# EAGLE design openSX70_ALADDIN_V398SEEED_20180219 (EAGLE 8.6.3)
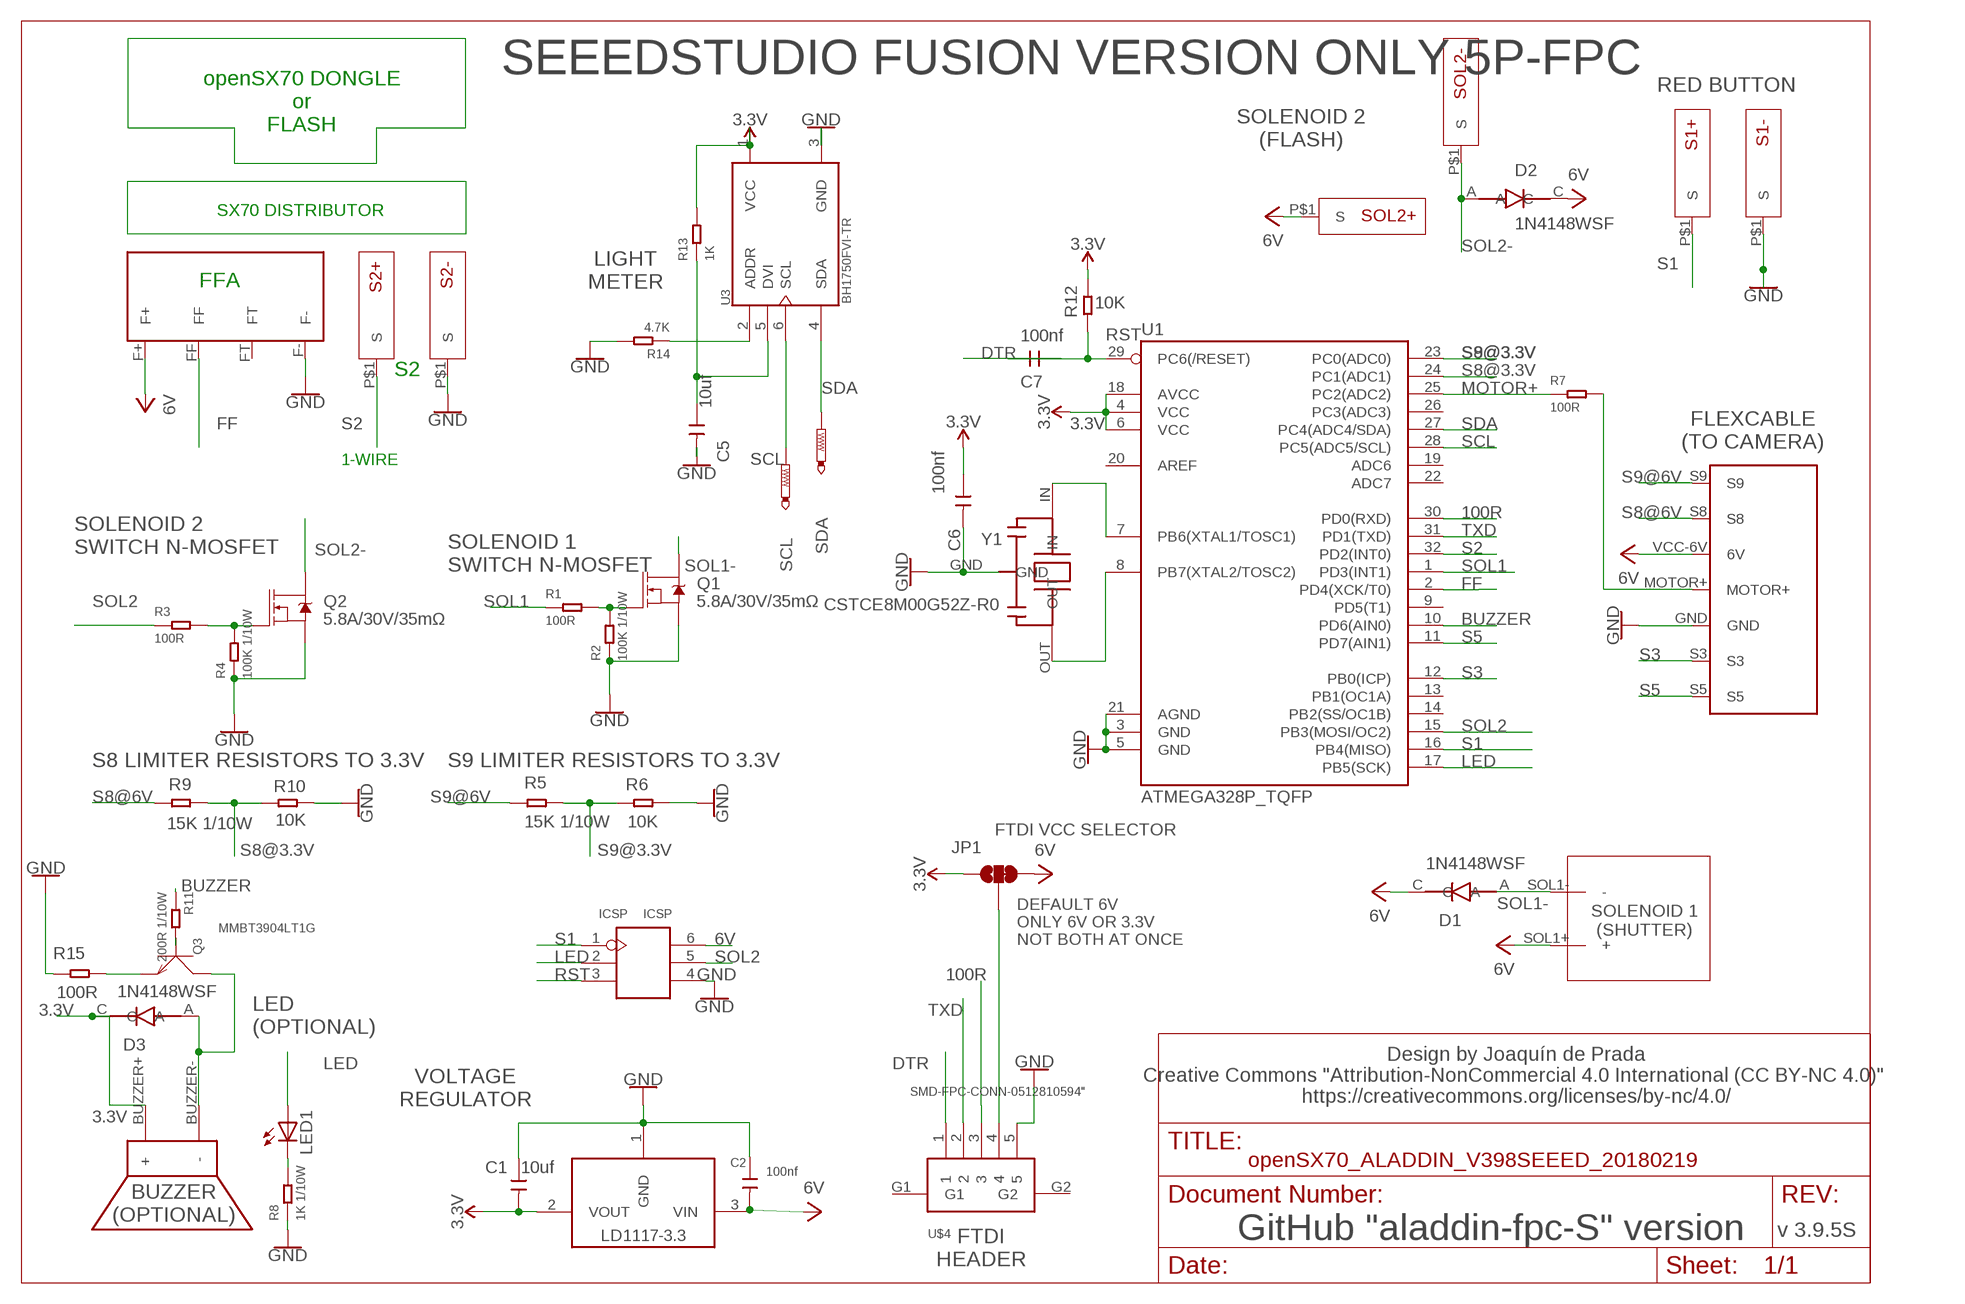
[diagram p0: schematic, sheet 1]

## Parts
C1  10uf  CERAMIC-10UF-10V-10%-X5R(0603)  [C0603]
C2  100nf  CERAMIC-100NF-50V-10%-X7R(0603)  [C0603]
C5  10uf  CERAMIC-10UF-10V-10%-X5R(0603)  [C0603]
C6  100nf  CERAMIC-100NF-50V-10%-X7R(0603)  [C0603]
C7  100nf  CERAMIC-100NF-50V-10%-X7R(0603)  [C0603]
D1  1N4148WSF  1N4148WS  [SODFL2512X100N]
D2  1N4148WSF  1N4148WS  [SODFL2512X100N]
D3  1N4148WSF  1N4148WS  [SODFL2512X100N]
ICSP  ICSP  [H2X3-2.54]
JP1  FTDI VCC SELECTOR  JUMPER-SMT_3_1-NC_TRACE_SILK  [SMT-JUMPER_3_1-NC_TRACE_SILK]
LD11172.5V  LD1117 2.5V  LD1117-3.3  [SOT223]
LED1  LEDCHIPLED_0805  [CHIPLED_0805]
Q1  5.8A/30V/35mΩ  MOSFET-NCH-AO3404A  [SOT23-3]
Q2  5.8A/30V/35mΩ  MOSFET-NCH-AO3404A  [SOT23-3]
Q3  MMBT3904LT1G  SMD-TRANSISTORS-NPN-40V-200MA-MMBT3904LT1G(SOT-23)  [SOT-23]
R1  100R  SMD-RES-100R-5%-1/10W(0603)  [R0603]
R2  100K 1/10W  SMD-RES-100K-5%-1/10W(0603)  [R0603]
R3  100R  SMD-RES-100R-5%-1/10W(0603)  [R0603]
R4  100K 1/10W  SMD-RES-100K-5%-1/10W(0603)  [R0603]
R5  15K 1/10W  SMD-RES-15K-1%-1/10W(0603)  [R0603]
R6  10K  SMD-RES-10K-1%-1/10W(0603)  [R0603]
R7  100R  SMD-RES-100R-5%-1/10W(0603)  [R0603]
R8  1K 1/10W  SMD-RES-1K-5%-1/10W(0603)  [R0603]
R9  15K 1/10W  SMD-RES-15K-1%-1/10W(0603)  [R0603]
R10  10K  SMD-RES-10K-1%-1/10W(0603)  [R0603]
R11  200R 1/10W  SMD-RES-200R-5%-1/10W(0603)  [R0603]
R12  10K  SMD-RES-10K-1%-1/10W(0603)  [R0603]
R13  1K  SMD-RES-1K-1%-1/10W(0603)  [R0603]
R14  4.7K  SMD-RES-4.7K-5%-1/10W(0603)  [R0603]
R15  100R  SMD-RES-100R-5%-1/10W(0603)  [R0603]
S1+  SX70-S-PAD-NEW  [SX70-S-PAD2]
S1-  SX70-S-PAD-NEW  [SX70-S-PAD2]
S2+  SX70-S-PAD-NEW  [SX70-S-PAD2]
S2-  SX70-S-PAD-NEW  [SX70-S-PAD2]
SCL  PTR1TP08R  [TP08R]
SDA  PTR1TP08R  [TP08R]
SOL1  SX70-SOLENOID1-2PADS  [SX70-SOLENOID1-2]
SOL2+  SX70-S-PAD-NEW  [SX70-S-PAD2]
SOL2-  SX70-S-PAD-NEW  [SX70-S-PAD2]
U1  ATMEGA328P_TQFP  [TQFP32-08]
U3  BH1750FVI-TR  [SOTFL50P300X75-6N]
U$1  SX70-7-PAD  [SX70-7-PAD]
U$2  FFA  SX70-FFA-PAD  [FFA-PAD-PACKAGE]
U$3  CSET8-5G_V2  [CSET8-5G_PACKAGE]
U$4  SMD-FPC-CONN-0512810594"  [51281-0594]
Y1  CSTCE8M00G52Z-R0  CSTCE16M0V53-R0  [CFP95P160X100-3N]

## Nets
3.3V: C1.2 C6.1 D3.C JP1.1 LD11172.5V.2(VOUT) R12.2 R13.2 U1.4(VCC) U1.6(VCC) U1.18(AVCC) U3.1(VCC) U$3.BUZZER+(+)
6V: C2.2 D1.C D2.C ICSP.6(VCC) JP1.3 LD11172.5V.3(VIN) SOL1.SOL1+(+) SOL2+.P$1(S) U$1.VCC-6V(6V) U$2.F+
100R: U1.30(PD0(RXD)) U$4.3
BUZZER: R11.1 U1.10(PD6(AIN0))
BUZZER-: D3.A Q3.3(C) U$3.BUZZER-(-)
DTR: C7.1 U$4.1
FF: U1.2(PD4(XCK/T0)) U$2.FF
GND: C1.1 C2.1 C5.2 C6.2 ICSP.4(GND) LD11172.5V.1(GND) Q1.2(S) Q2.2(S) R2.1 R4.1 R6.2 R8.1 R10.2 R14.2 R15.1 S1-.P$1(S) S2-.P$1(S) U1.3(GND) U1.5(GND) U1.21(AGND) U3.3(GND) U$1.GND U$2.F- U$4.5 Y1.GND
LED: ICSP.2(SCK) LED1.A U1.17(PB5(SCK))
MOTOR+: R7.1 U1.25(PC2(ADC2))
MOTOR-HEADER: R7.2 U$1.MOTOR+
N$1: Q1.1(G) R1.2 R2.2
N$2: C5.1 R13.1 U3.5(DVI)
N$3: Q2.1(G) R3.2 R4.2
N$4: U1.7(PB6(XTAL1/TOSC1)) Y1.IN
N$5: LED1.C R8.2
N$6: U1.8(PB7(XTAL2/TOSC2)) Y1.OUT
N$9: Q3.1(B) R11.2
N$10: R14.1 U3.2(ADDR)
N$27: JP1.2 U$4.4
N$28: Q3.2(E) R15.2
RST: C7.2 ICSP.3(RST) R12.1 U1.29(PC6(/RESET))
S1: ICSP.1(MISO) S1+.P$1(S) U1.16(PB4(MISO))
S2: S2+.P$1(S) U1.32(PD2(INT0))
S3: U1.12(PB0(ICP)) U$1.S3
S5: U1.11(PD7(AIN1)) U$1.S5
S8@3.3V: R9.2 R10.1 U1.24(PC1(ADC1))
S8@6V: R9.1 U$1.S8
S9@3.3V: R5.2 R6.1 U1.23(PC0(ADC0))
S9@6V: R5.1 U$1.S9
SCL: SCL.TP U1.28(PC5(ADC5/SCL)) U3.6(SCL)
SDA: SDA.TP U1.27(PC4(ADC4/SDA)) U3.4(SDA)
SOL1: R1.1 U1.1(PD3(INT1))
SOL1-: D1.A Q1.3(D) SOL1.SOL1-(-)
SOL2: ICSP.5(MOSI) R3.1 U1.15(PB3(MOSI/OC2))
SOL2-: D2.A Q2.3(D) SOL2-.P$1(S)
TXD: U1.31(PD1(TXD)) U$4.2
Unconnected: U1.9(PD5(T1)) U1.13(PB1(OC1A)) U1.14(PB2(SS/OC1B)) U1.19(ADC6) U1.20(AREF) U1.22(ADC7) U1.26(PC3(ADC3)) U$2.FT U$4.G1 U$4.G2

## Notes on the sheet
- SEEEDSTUDIO FUSION VERSION ONLY 5P-FPC
- RED BUTTON
- openSX70 DONGLE
  or
  FLASH
- SOLENOID 2
  (FLASH)
- SX70 DISTRIBUTOR
- LIGHT
  METER
- FFA
- S2
- FLEXCABLE
  (TO CAMERA)
- 1-WIRE
- SOLENOID 2
  SWITCH N-MOSFET
- SOLENOID 1
  SWITCH N-MOSFET
- S8 LIMITER RESISTORS TO 3.3V | S9 LIMITER RESISTORS TO 3.3V
- SOLENOID 1
  (SHUTTER)
- DEFAULT 6V
  ONLY 6V OR 3.3V
  NOT BOTH AT ONCE
- LED
  (OPTIONAL)
- Design by Joaquín de Prada
  Creative Commons "Attribution-NonCommercial 4.0 International (CC BY-NC 4.0)" 
  https://creativecommons.org/licenses/by-nc/4.0/
- VOLTAGE
  REGULATOR
- BUZZER
  (OPTIONAL)
- v 3.9.5S
- GitHub "aladdin-fpc-S" version
- FTDI
  HEADER

## Library data of the parts
C1 C5 = Seeed-Capacitor:CERAMIC-10UF-10V-10%-X5R(0603): 302010103; MPN: CC0603KRX5R6BB106
C2 C6 C7 = Seeed-Capacitor:CERAMIC-100NF-50V-10%-X7R(0603): 302010138; MPN: CC0603KRX7R9BB104
D1-D3 = Common-Parts-Library-Eagle:1N4148WS: 1N4148WS Series 75 V 300 mA Surface Mount Small Signal Diodes - SOD-323F; MANUFACTURER: Fairchild Semiconductor
ICSP = openSX70:ICSP
JP1 = SparkFun-Jumpers:JUMPER-SMT_3_1-NC_TRACE: Normally closed trace jumper (1 of 2 connections) This jumper has a trace between two pads so it's normally closed (NC). The other connection is normally open (NO). Use a razor knife to open the connection. For best results follow the IPC guidelines for cutting traces: Cutout at least 0.063 mm (0.005 in). Remove all loose material to clean up the cut area. Seal the cut with an approved epoxy. Reapply solder to reclose the connection, or to close the NO connection.
LD11172.5V = openSX70:LD1117-3.3; AVAILABILITY: Unavailable; DESCRIPTION: Sot223/Pkg 1-Amp 5-Volt Low Drop Out Voltage Regulatator; MF: Advanced Monolithic Systems; MP: AMS1117-5.0; PACKAGE: None; PRICE: None
LED1 = led:LED: LED OSRAM: - CHIPLED LG R971, LG N971, LY N971, LG Q971, LY Q971, LO R971, LY R971 LH N974, LH R974 LS Q976, LO Q976, LY Q976 LO Q996 - Hyper CHIPLED LW Q18S LB Q993, LB Q99A, LB R99A - SideLED LS A670, LO A670, LY A670, LG A670, LP A670 LB A673, LV A673, LT A673, LW A673 LH A674 LY A675 LS A676, LA A676, LO A676, LY A676, LW A676 LS A679, LY A679, LG A679 - Hyper Micro SIDELED® LS Y876, LA Y876, LO Y876, LY Y876 LT Y87S - SmartLED LW L88C, LW L88S LB L89C, LB L89S, LG L890 LS L89K, LO L89K, LY L89K LS L896, LA L896, LO L896, LY L896 - TOPLED LS T670, LO T670, LY T670, LG T670, LP T670 LSG T670, LSP T670, LSY T670, LOP T670, LYG T670 LG T671, LOG T671, LSG T671 LB T673, LV T673, LT T673, LW T673 LH T674 LS T676, LA T676, LO T676, LY T676, LB T676, LH T676, LSB T676, LW T676 LB T67C, LV T67C, LT T67C, LS T67K, LO T67K, LY T67K, LW E67C LS E67B, LA E67B, LO E67B, LY E67B, LB E67C, LV E67C, LT E67C LW T67C LS T679, LY T679, LG T679 LS T770, LO T770, LY T770, LG T770, LP T770 LB T773, LV T773, LT T773, LW T773 LH T774 LS E675, LA E675, LY E675, LS T675 LS T776, LA T776, LO T776, LY T776, LB T776 LHGB T686 LT T68C, LB T68C - Hyper Mini TOPLED® LB M676 - Mini TOPLED Santana® LG M470 LS M47K, LO M47K, LY M47K Source: http://www.osram.convergy.de LUXEON: - LUMILED® LXK2-PW12-R00, LXK2-PW12-S00, LXK2-PW14-U00, LXK2-PW14-V00 LXK2-PM12-R00, LXK2-PM12-S00, LXK2-PM14-U00 LXK2-PE12-Q00, LXK2-PE12-R00, LXK2-PE12-S00, LXK2-PE14-T00, LXK2-PE14-U00 LXK2-PB12-K00, LXK2-PB12-L00, LXK2-PB12-M00, LXK2-PB14-N00, LXK2-PB14-P00, LXK2-PB14-Q00 LXK2-PR12-L00, LXK2-PR12-M00, LXK2-PR14-Q00, LXK2-PR14-R00 LXK2-PD12-Q00, LXK2-PD12-R00, LXK2-PD12-S00 LXK2-PH12-R00, LXK2-PH12-S00 LXK2-PL12-P00, LXK2-PL12-Q00, LXK2-PL12-R00 Source: www.luxeon.com KINGBRIGHT: KA-3528ASYC Source: www.kingbright.com
Q1 Q2 = openSX70:MOSFET-NCH: N-channel MOSFETs Voltage controlled devices that allow control of high current outputs. SparkFun Products: SparkFun OpenScale <https://www.sparkfun.com/products/13261> SparkFun Digital Sandbox <https://www.sparkfun.com/products/12651> SparkFun Monster Moto Shield <https://www.sparkfun.com/products/10182> SparkFun MOSFET Power Controller <https://www.sparkfun.com/products/11214>; PROD_ID: TRANS-12988
Q3 = Seeed-Transistor:SMD-TRANSISTORS-NPN-40V-200MA-MMBT3904LT1G(SOT-23): 305010013; MPN: MMBT3904LT1G
R1 R3 R7 R15 = Seeed-Resistor:SMD-RES-100R-5%-1/10W(0603): 301010090; MPN: RC0603JR-07100RL
R2 R4 = Seeed-Resistor:SMD-RES-100K-5%-1/10W(0603): 301010089; MPN: RC0603JR-07100KL
R5 R9 = Seeed-Resistor:SMD-RES-15K-1%-1/10W(0603): 301010241; MPN: RC0603FR-0715KL
R6 R10 R12 = Seeed-Resistor:SMD-RES-10K-1%-1/10W(0603): 301010299; MPN: RC0603FR-0710KL
R8 = Seeed-Resistor:SMD-RES-1K-5%-1/10W(0603): 301010291; MPN: RC0603JR-071KL
R11 = Seeed-Resistor:SMD-RES-200R-5%-1/10W(0603): 301010218; MPN: RC0603JR-07200RL
R13 = Seeed-Resistor:SMD-RES-1K-1%-1/10W(0603): 301010298; MPN: RC0603FR-071KL
R14 = Seeed-Resistor:SMD-RES-4.7K-5%-1/10W(0603): 301010290; MPN: RC0603JR-074K7L
S1+ S1- S2+ S2- SOL2+ SOL2- = openSX70:SX70-S-PAD-NEW
SCL SDA = testpad:PTR1: TEST PIN
SOL1 = openSX70:SX70-SOLENOID1-2PADS
U1 = openSX70:ATMEGA328P_TQFP: Popular 328P in QFP Storefront component: ATmega328 - TQFP (COM-13448) Datasheet SparkFun Products SparkFun RedBoard - Programmed with Arduino (DEV-12757) Arduino Pro Mini 328 - 5V/16MHz (DEV-11113) Arduino Pro Mini 328 - 3.3V/8MHz (DEV-11114) SparkFun OpenLog (DEV-13712) SparkFun MicroView - OLED Arduino Module (DEV-12923) SparkFun Digital Sandbox (DEV-12651) SparkFun PicoBoard (WIG-11888) Arduino Fio (DEV-10116) LilyPad Arduino 328 Main Board (DEV-13342) SparkFun RedStick (DEV-13741) LilyPad MP3 (DEV-11013) LilyPad Arduino SimpleSnap (DEV-10941) SparkFun Stepoko (ROB-13899) SparkFun Geiger Counter (SEN-11345) SparkFun EL Sequencer (COM-12781) Arduino Pro 328 - 5V/16MHz (DEV-10915) CryptoCape (DEV-12773) SparkFun IR Thermometer Evaluation Board - MLX90614 (SEN-10740) SparkFun RedBot Mainboard (ROB-12097) Arduino Pro 328 - 3.3V/8MHz (DEV-10914) SparkFun Block for Intel® Edison - Arduino (DEV-13036) SparkFun Simon Says - Surface Mount Soldering Kit (KIT-10935) SparkFun 7-Segment Serial Display - Red (COM-11441) SparkFun 7-Segment Serial Display - White (COM-11629) SparkFun 7-Segment Serial Display - Yellow (COM-11443) SparkFun 7-Segment Serial Display - Kelly Green (COM-11440) SparkFun 7-Segment Serial Display - Blue (COM-11442) SparkFun OpenSegment Serial Display - 20mm (Blue) (COM-11647) SparkFun OpenSegment Serial Display - 20mm (Green) (COM-11646) SparkFun OpenSegment Serial Display - 20mm (White) (COM-11648) SparkFun OpenSegment Serial Display - 20mm (Red) (COM-11644) SparkFun OpenSegment Serial Display - 20mm (Yellow) (COM-11645) SparkFun OpenSegment Shield (DEV-13190); PROD_ID: IC-09069
U3 = openSX70:BH1750FVI-TR: Light to Digital Ambient Light Sensor Digital O/P 1lux to 65535lux 6-Pin WSOF Embossed T/R; AVAILABILITY: Good; DESCRIPTION: Light to Digital Ambient Light Sensor Digital O/P 1lux to 65535lux 6-Pin WSOF Embossed T/R; MF: Rohm; MP: BH1750FVI-TR; PACKAGE: SMD-6 Rohm; PRICE: 2.38 USD
U$1 = openSX70:SX70-7-PAD
U$2 = openSX70:SX70-FFA-PAD
U$3 = openSX70:CSET8-5G_V2
U$4 = Seeed-OPL-2017-01-connector-edward:SMD-FPC-CONN-0512810594: 320060184
Y1 = CSTCE16M0V53-R0:CSTCE16M0V53-R0: Ceramic Resonator 16MHz ±0.5% (Tol) ±0.3% (Stability) 15pF 40Ohm 3-Pin CSMD T/R; AVAILABILITY: Good; DESCRIPTION: Ceramic Resonator 16MHz ??0.5% (Tol) ??0.3% (Stability) 15pF 40Ohm 3-Pin CSMD T/R; MF: Murata; MP: CSTCE16M0V53-R0; PACKAGE: SMD-3 Murata; PRICE: 0.28 USD

## Board
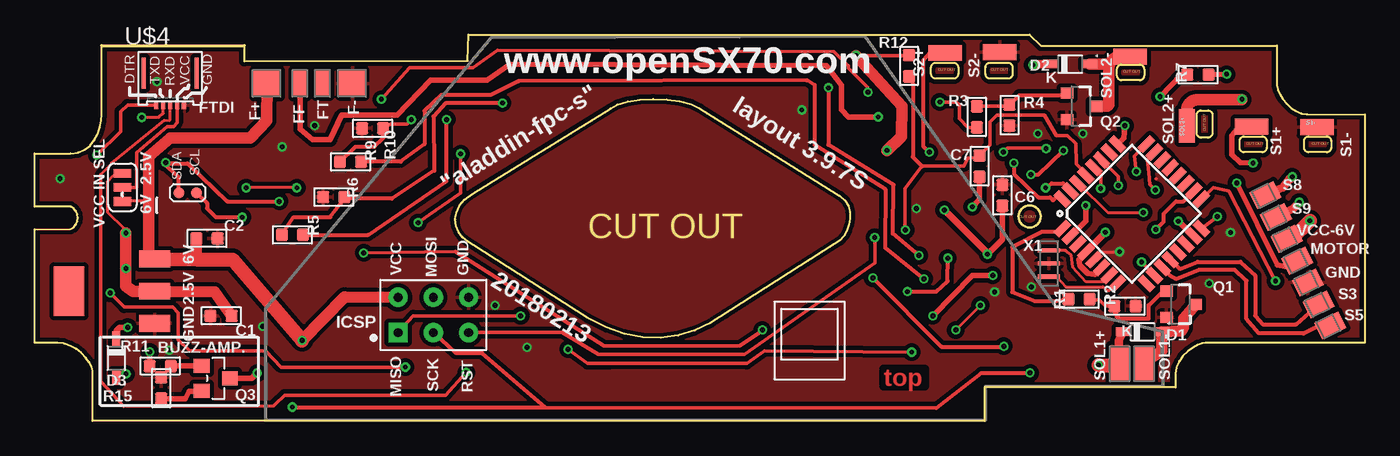
[diagram p1: board, top side]
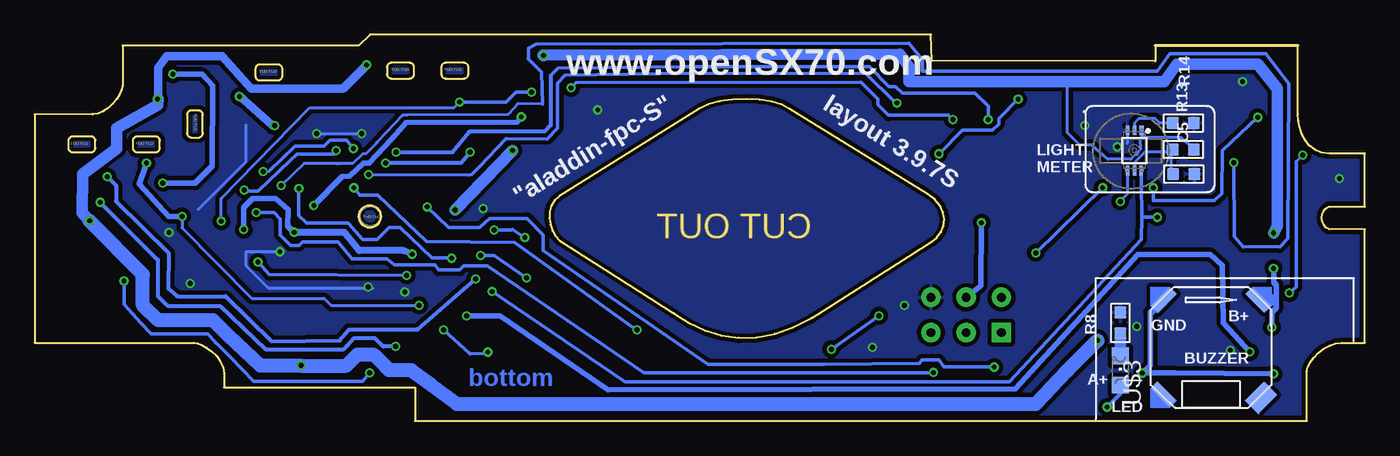
[diagram p2: board, bottom side, seen from below]

Size 95.88 x 27.86 mm. Coordinates in mm from the lower left corner, seen from the top.
Outline: 380 segments
Copper layers (1*16): Top 0.035mm / dielectric 1.5mm / Bottom 0.035mm
Design rules "SeeedStudio_2layer_DRU_no_angle_20140221": minimum track width 6mil, minimum drill 12mil, track to track 6mil, track to pad 6mil, pad to pad 6mil, via to via 6mil, smd to smd 0mil, copper to edge 10mil, drill to drill 10mil, minimum pad ring 10mil, minimum via ring 6mil, stop-mask expansion 2mil, vias tented up to drill 100mil, thermal gap 10mil

### Footprints (pad centres in the part's own frame; a part is rotated, then mirrored left to right if it is on the bottom)
C0603 = smd 0.889 x 0.889: 1 0,0.762; 2 0,-0.762
SODFL2512X100N = smd 1.05 x 0.6: A 1.4,0; C -1.4,0
H2X3-2.54 = drill 0.635 pad 1.397 square: 1 -1.27,2.54 | drill 0.635 pad 1.397: 2 -1.27,0; 3 -1.27,-2.54; 4 1.27,-2.54; 5 1.27,0; 6 1.27,2.54
SMT-JUMPER_3_1-NC_TRACE_SILK = smd 0.635 x 1.27: 1 -1.016,0; 2 0,0; 3 1.016,0
SOT223 = smd 2.235 x 1.219: 1 -3.099,2.311; 2 -3.099,0; 3 -3.099,-2.311 | smd 2.2 x 3.6: 4 3.099,0
CHIPLED_0805 = smd 1.2 x 1.2: A 0,-1.05; C 0,1.05
SOT23-3 = smd 0.8 x 0.9: 1 -0.95,-1; 2 0.95,-1; 3 0,1.1
SOT-23 = smd 1.016 x 1.143: 1 -0.889,-1.016; 2 0.889,-1.016; 3 0,1.016
R0603 = smd 0.889 x 0.889: 1 0,0.762; 2 0,-0.762
SX70-S-PAD2 = smd 2.413 x 1.143: P$1 0.01,0.087
TP08R = smd 0.8 x 0.8: TP 0,0
SX70-SOLENOID1-2 = smd 1.372 x 2.54: SOL1+ -0.826,0.127; SOL1- 0.953,0.127
TQFP32-08 = smd 1.27 x 0.559: 1 -4.293,2.8; 2 -4.293,2; 3 -4.293,1.2; 4 -4.293,0.4; 5 -4.293,-0.4; 6 -4.293,-1.2; 7 -4.293,-2; 8 -4.293,-2.8; 17 4.293,-2.8; 18 4.293,-2; 19 4.293,-1.2; 20 4.293,-0.4; 21 4.293,0.4; 22 4.293,1.2; 23 4.293,2; 24 4.293,2.8 | smd 0.559 x 1.27: 9 -2.8,-4.293; 10 -2,-4.293; 11 -1.2,-4.293; 12 -0.4,-4.293; 13 0.4,-4.293; 14 1.2,-4.293; 15 2,-4.293; 16 2.8,-4.293; 25 2.8,4.293; 26 2,4.293; 27 1.2,4.293; 28 0.4,4.293; 29 -0.4,4.293; 30 -1.2,4.293; 31 -2,4.293; 32 -2.8,4.293
SOTFL50P300X75-6N = smd 0.702 x 0.3: 1 -1.451,0.525 | smd 0.702 x 0.25: 2 -1.451,0; 3 -1.451,-0.5; 4 1.451,-0.5; 5 1.451,0; 6 1.451,0.5
SX70-7-PAD = smd 1.31 x 1.93 rotated 296: GND 3.404,0.495; MOTOR+ 2.654,2.07; S3 4.204,-1.067; S5 5.016,-2.591; S8 0.356,6.807; S9 1.118,5.232; VCC-6V 1.88,3.658
FFA-PAD-PACKAGE = smd 1.95 x 1.95: F+ -3.277,-0.013; F- 2.87,0 | smd 1.05 x 1.95: FF -0.914,0; FT 0.737,0.025
CSET8-5G_PACKAGE = smd 1.88 x 0.686 rotated 225: BUZZER+ 3.054,-3.114 | smd 1.88 x 0.686 rotated 315: BUZZER- 3.051,3.742 | smd 1.88 x 0.686 rotated 45: BUZZER-2 -3.742,3.749 | smd 1.9 x 1.3 rotated 135: BUZZER-3 -3.99,-3.29
51281-0594 = smd 0.305 x 0.61: 1 1.3,-3.85; 2 1.8,-3.85; 3 2.3,-3.85; 4 2.8,-3.85; 5 3.3,-3.85 | smd 0.3 x 2.25: G1 0.4,-1.55; G2 4.2,-1.55
CFP95P160X100-3N = smd 0.3 x 1.6: GND 0.038,0.175; IN -0.912,0.177; OUT 0.992,0.174

### Placement (x,y rotation side)
C1  13.44,7.58 90 top
C2  12.42,13.17 270 top
C5  13.05,17.8 90 bottom
C6  69.76,16.28 180 top
C7  68.11,18.37 180 top
D1  79.86,6.43 0 top
D2  74.65,25.74 0 top
D3  5.88,4.53 270 top
ICSP  28.74,7.64 90 top
JP1  6.32,16.85 270 top
LD11172.5V  5.56,9.36 180 top
LED1  17.63,3.64 0 bottom
Q1  82.59,8.4 270 top
Q2  75.41,22.69 270 top
Q3  13.05,3.07 270 top
R1  75.28,8.78 90 top
R2  78.59,8.28 270 top
R3  67.92,21.93 180 top
R4  70.27,22.06 180 top
R5  18.58,13.42 270 top
R6  21.56,16.15 270 top
R7  83.86,24.98 90 top
R8  17.63,7.07 0 bottom
R9  22.77,18.69 270 top
R10  24.36,21.1 270 top
R11  9.05,3.96 90 top
R12  63.03,25.61 180 top
R13  13.09,19.58 90 bottom
R14  13.09,21.48 90 bottom
R15  9.12,2.37 0 top
S1+  87.72,21.14 0 top
S1-  92.42,21.09 0 top
S2+  65.62,26.46 0 top
S2-  69.56,26.51 0 top
SCL  11.66,16.47 0 top
SDA  10.39,16.47 0 top
SOL1  79.03,4.05 0 top
SOL2+  83.14,21.28 90 top
SOL2-  78.96,26.19 0 top
U1  79.09,14.94 45 top
U3  16.61,19.52 270 bottom
U$1  88.37,9.48 0 top
U$2  20.04,24.34 0 top
U$3  10.77,5.67 90 bottom
U$4  7.47,26.63 0 top
Y1  72.94,11.39 270 top

### Tracks (layer width: path | path; a pad name or v marks a point on that pad's centre or on a via)
3.3V  (via drill 0.35)
  Top 0.203: 83.51,16.5 U1.18 | JP1.1 6.27,17.69 5.66,17.69 5.26,17.28 5.26,15.05 6.48,13.83 v6.58,13.55 | 8.67,9.34 LD11172.5V.2
  Top 0.254: v59.19,26.36 62.61,26.36 R12.2
  Top 0.305: v80.81,13.8 81.38,14.37 81.38,14.94 82.27,15.83 82.81,15.83 83.51,16.5
  Top 0.406: U1.4 75.28,11.64 75.35,11.2 75.92,10.63 76.41,10.56 U1.6 | C6.1 69.76,13.1 v68.68,12.02 | v6.7,6.75 6.13,6.75 5.88,6.5 D3.C
  Top 0.508: U1.4 v77.19,13.6 v77.19,13.61 | v65.57,15.21 68.68,12.1 v68.68,12.02
  Top 0.813: v6.58,13.55 v6.58,11.01 6.58,9.74 7.09,9.36 LD11172.5V.2 12.99,9.29 C1.2 | v61.44,19.52 62.49,20.49 62.51,22.71 v59.19,26.36
  Bottom 0.203: 21.44,24.47 21.44,20.79 20.55,19.9 19.66,19.9 18.52,18.88 16.86,18.88 16.17,19.57 16.2,20.34 16.07,20.47 13.31,20.47 12.39,19.67 R13.2 | 77.32,13.8 v77.19,13.61
  Bottom 0.254: 16.07,20.47 16.07,20.88 U3.1
  Bottom 0.406: v77.19,13.61 77.37,13.78 77.65,14.04 77.6,15.26 78.52,16.02 80.17,16.02 80.81,15.39 v80.81,13.8 | v6.7,6.75 6.7,7.83 6.38,8.16 6.38,8.97 | v6.58,11.01 6.58,9.99 6.38,9.79 6.38,8.97 | 6.63,8.73 arc-90 6.38,8.97
  Bottom 0.508: v77.19,13.61 73.57,13.61 72.49,12.28 69.3,12.28 v68.68,12.02
  Bottom 0.813: v6.58,13.55 6.32,14.05 6.32,23.96 7.72,25.74 13.57,25.74 14.45,24.46 18.09,24.47 21.44,24.47 32.87,24.47 32.87,25.55 33.5,26.44 59.22,26.37 v59.19,26.36 | v61.44,19.52 v65.57,15.21 | U$3.BUZZER+ 6.63,8.73
6V  (via drill 0.35)
  Top 0.152: v87.03,23.2 86.84,23.33 87.03,23.17
  Top 0.203: JP1.3 6.48,15.86 8,15.86 8.22,11.94 | 16.99,8.72 14.26,11.64
  Top 0.61: U$1.VCC-6V 90.63,13.14 | v71.95,25.68 arc-90 72.01,25.74 D2.C | 78.54,4.65 77.95,4.02 | SOL1.SOL1+ 78.14,5.26 78.14,5.82 D1.C
  Top 0.813: U$2.F+ 16.74,21.67 15.54,20.4 9.75,20.4 8.23,19.07 8.22,11.94 LD11172.5V.3 | 91.89,14.41 v91.92,14.44 | SOL2+.P$1 83.05,22.42 arc-90 83.79,23.17 87.03,23.17 | C2.2 11.66,11.65 | v19.28,5.8 22.35,8.94 ICSP.6
  Top 1.016: 90.63,13.14 v91.92,14.44 | v19.28,5.8 14.26,11.64 12.93,11.64 11.66,11.65 LD11172.5V.3 | v76.68,4.01 77.95,4.02 SOL1.SOL1+
  Bottom 0.152: v87.03,23.2 86.84,23.33 86.99,23.2
  Bottom 0.61: v71.95,25.68 73.67,23.96 80.27,23.96 82.36,26.31 86.37,26.31 86.97,25.48 86.99,23.2
  Bottom 0.813: 86.71,7.26 86.97,7.26 | 69.7,3.63 70.36,3.65 | 76.68,3.98 v76.68,4.01 | 86.99,23.2 87,22.79 89.95,21.13 89.95,19.64 92.43,17.8 92.46,15.01 v91.92,14.44
  Bottom 1.016: 86.71,7.26 83.03,7.26 81.89,6.12 79.6,3.98 76.68,3.98 73.42,3.98 72.62,4.78 71.46,4.78 70.56,3.89 70.31,3.65 | 86.97,7.26 88.08,8.34 88.08,10.56 v91.92,14.44 | v19.28,5.8 21.44,3.64 23.72,1.23 65.44,1.23 67.35,2.65 68.74,3.65 70.31,3.65 | 70.31,3.65 70.36,3.65
100R  (via drill 0.35)
  Top 0.203: U1.30 75.32,17.04 77.36,15.03 v79.92,15.04 | 4.77,17.77 5.56,18.56 5.53,18.56 9.36,21.68 9.72,21.67 9.77,21.72 U$4.3
  Top 0.254: v31.11,3.49 29.63,1.86 18,1.85 17.32,1.2 17.22,1.09 6.42,1.07 4.77,2.85 4.77,17.77
  Bottom 0.254: v79.92,15.04 78.64,15.01 78.21,14.56 78.21,13.42 77.44,12.66 76.81,12.66 76.55,12.91 74.01,12.91 73,11.67 70.49,11.67 69.95,11.26 67.03,11.26 66.78,10.88 65.25,10.88 64.97,11.17 63.22,11.17 51.96,3.48 31.43,3.48 v31.11,3.49
BUZZER  (via drill 0.35)
  Top 0.254: 80.78,10.46 v79.79,11.45
  Top 0.305: U1.10 80.78,10.46
  Top 0.406: v64.74,7.58 67.6,10.5 v69.06,10.5 | v8.29,4.97 R11.1
  Bottom 0.254: 79.6,11.27 v79.79,11.45 78.97,10.56 v69.06,10.5
  Bottom 0.305: 64.76,7.59 v64.74,7.58
  Bottom 0.406: 64.76,7.59 62.32,7.59 54.56,2.24 25.18,2.31 16.36,12.02 11.15,12.02 10.26,11.2 10.2,7.07 v8.29,4.97
BUZZER-  (via drill 0.35)
  Top 0.406: Q3.3 15.66,3.07 v16.04,3.45 | D3.A 5.92,3.39 v6.58,3.39
  Bottom 0.406: 15.4,7.83 15.47,7.83 15.47,4.02 v16.04,3.45 15.87,3.47 14.1,3.47 13.69,3.45 v6.58,3.39
  Bottom 0.508: U$3.BUZZER- 15.4,7.83
DTR  (via drill 0.35)
  Top 0.254: v26.72,3.88 26.72,3.85 17.78,3.86 16.64,5.04 11.17,5.04 10.36,5.85 10.36,7.79 9.94,8.21 6.45,8.21 v5.43,9.23 | v4.48,19.17 6.2,20.88 6.2,22.31 6.7,22.79 8.76,22.79 U$4.1
  Top 0.406: C7.1 68.11,15.96 v67.59,15.44
  Bottom 0.203: 4.93,18.72 v4.48,19.17
  Bottom 0.254: v67.59,15.44 66.05,13.96 63.83,13.95 63.08,14.6 60.4,14.6 59.22,13.42 59.22,12.28 47.34,4.08 39,4.09 32.1,4.15 31.93,4.39 31.24,4.4 30.71,4.4 30.35,3.89 v26.72,3.88 | 4.93,18.72 4.93,9.67 v5.43,9.23
FF  (via drill 0.35)
  Top 0.406: 19.53,23.94 U$2.FF | v75.76,15.55 75.77,14.44 75.76,14.44 U1.2 | U$2.FF 19.15,24.32 | U$2.FF 19.13,21.9 19.15,21.04 20.04,20.28 21.31,20.28 22.14,22.06 26.14,22.06 28.55,24.6 32.61,24.6 34.26,25.74 57.06,25.61 58.14,24.21 58.14,22.44 58.65,21.93 v60.81,21.93
  Bottom 0.406: v60.81,21.93 61.12,21.55 69.1,21.53 70.1,20.39 69.99,20.53 70.14,20.34 71.76,18.6 72.18,18.6 73.16,17.66 73.73,17.64 v75.76,15.55
GND  (via drill 0.35)
  Top 0.203: 22.73,24.19 U$2.F- | 74.55,21.75 Q2.2 | v78.21,12.2 76.78,12.2 76.38,11.79 U1.5 | 80.81,17.45 80.87,17.47 | 81.6,17.93 U1.21
  Bottom 0.203: v75.56,20.73 v72.31,20.73 | 80.64,21.34 80.64,18.7 84.1,15.25 | v78.21,12.2 80.64,12.2 80.64,11.18 79.02,9.56 71.5,9.56 | U3.3 17.12,20.02
  other vias: 20.18,21.29 16.43,6.82 17.83,19.77 8.81,24.47 1.83,17.48 55.3,22.44 63.55,15.32 33.2,8.34 35.48,5.29 86.21,13.6 9.7,5.1 84.68,9.91 71.86,9.66 69.2,9.3
  pour Top (isolate 0.305): 91.7,22.11 91.77,22.11 95.88,22.11 95.88,5.64 84.4,5.64 84.15,5.6 83.83,5.47 83.48,5.27 83.11,5.01 82.78,4.68 82.5,4.3 82.31,3.87 82.24,3.4 82.24,2.41 68.47,2.41 68.47,0 4.17,0 4.17,3.6 4.11,3.9 3.94,4.23 3.69,4.56 3.36,4.89 2.98,5.18 2.56,5.42 2.11,5.58 1.66,5.64 0,5.64 0,13.82 2.59,13.84 2.81,13.96 2.98,14.15 3.07,14.39 3.1,14.65 3.07,14.91 2.97,15.15 2.81,15.34 2.59,15.45 0,15.46 0,19.29 2.59,19.29 3.14,19.36 3.6,19.56 3.99,19.87 4.3,20.25 4.53,20.7 4.7,21.17 4.79,21.65 4.82,22.11 4.82,27.07 15.1,27.07 15.1,25.94 31.21,25.85 31.28,27.86 71.71,27.86 72.52,27.07 89.55,27.07 89.55,24.21 89.61,23.9 89.76,23.56 89.97,23.21 90.25,22.87 90.57,22.57 90.93,22.33 91.31,22.17
  pour Bottom (isolate 0.305): 91.7,22.11 91.77,22.11 95.88,22.11 95.88,5.64 84.4,5.64 84.15,5.6 83.83,5.47 83.48,5.27 83.11,5.01 82.78,4.68 82.5,4.3 82.31,3.87 82.24,3.4 82.24,2.41 68.47,2.41 68.47,0 4.17,0 4.17,3.6 4.11,3.9 3.94,4.23 3.69,4.56 3.36,4.89 2.98,5.18 2.56,5.42 2.11,5.58 1.66,5.64 0,5.64 0,13.82 2.59,13.84 2.81,13.96 2.98,14.15 3.07,14.39 3.1,14.65 3.07,14.91 2.97,15.15 2.81,15.34 2.59,15.45 0,15.46 0,19.29 2.59,19.29 3.14,19.36 3.6,19.56 3.99,19.87 4.3,20.25 4.53,20.7 4.7,21.17 4.79,21.65 4.82,22.11 4.82,27.07 15.1,27.07 14.98,25.69 31.08,25.85 31.28,27.86 71.71,27.86 72.52,27.07 89.55,27.07 89.55,24.21 89.61,23.9 89.76,23.56 89.97,23.21 90.25,22.87 90.57,22.57 90.93,22.33 91.31,22.17
LED  (via drill 0.35)
  Top 0.254: U1.17 84.96,16.85 86.08,16.59 v89.45,10.09
  Top 0.305: v71.75,3.46 68.24,3.45 65,0.93 36.8,0.97 | ICSP.2 30.33,4.91 32.23,4.91 36.8,0.97 | v18.58,0.99 36.8,0.97
  Bottom 0.254: v71.75,3.46 72.25,2.87 80.1,2.87 81.76,4.57 82.66,5.47 82.88,5.68 83.41,6.28 87.48,6.28 88.24,7.07 89.45,8.4 v89.45,10.09
  Bottom 0.305: LED1.A 17.6,1.98 v18.58,0.99
MOTOR+  (via drill 0.35)
  Top 0.406: U1.25 78.52,20.4 78.59,21.23 v78.59,21.29 | v81.13,23.39 82.68,25 R7.1
  Bottom 0.406: v78.59,21.29 78.71,21.29
  Bottom 0.61: 78.71,21.29 81.13,23.45 v81.13,23.39
MOTOR-HEADER  (via drill 0.35)
  Top 0.406: U$1.MOTOR+ 91.03,11.51 90.14,11.13 89.57,11.26 v86.65,17.17 | v85.92,25.01 R7.2
  Bottom 0.406: v85.92,25.01 83.83,25.01 83.06,24.18 83.09,18.37 83.24,18.22 84.31,17.15 v86.65,17.17
N$1
  Top 0.152: R2.2 77.95,8.09 77.95,7.45 78.06,7.52
  Top 0.254: R1.2 76.11,8.72 76.74,8.72 77.19,8.28 R2.2
  Top 0.305: 77.86,7.86 78.06,7.52 78.14,7.39 80.3,7.39 80.3,8.34 81.31,9.35 Q1.1
N$2
  Bottom 0.203: C5.1 13.98,17.61 13.98,19.52 R13.1 14.04,19.39 15.84,19.39 15.88,19.35 16.61,18.62 U3.5
N$3
  Top 0.203: 74.3,23.48 Q2.1 | 70.33,22.69 R4.2
  Top 0.254: R3.2 70.33,22.69
  Top 0.305: 74.3,23.48 70.97,23.48 70.17,22.69 70.33,22.69
N$4
  Top 0.203: U1.7 77.02,10.04 75.79,10.04 74.84,11.06 74.71,11.96 74.31,12.3 73.37,12.3 | 73.37,12.3 Y1.IN | 73.13,12.34 73.37,12.3
N$5
  Bottom 0.813: LED1.C R8.2
N$6
  Top 0.203: Y1.OUT 73.67,10.4 74.33,9.67 77,9.67 77.32,9.42 77.47,9.42 U1.8
N$7
  pour Top: 71.72,15.54 71.88,15.53 72.03,15.48 72.17,15.41 72.29,15.31 72.39,15.19 72.46,15.06 72.51,14.91 72.52,14.74 72.51,14.58 72.46,14.43 72.39,14.3 72.29,14.18 72.17,14.08 72.03,14.01 71.88,13.96 71.72,13.94 71.56,13.96 71.41,14.01 71.28,14.08 71.16,14.18 71.06,14.3 70.99,14.43 70.94,14.58 70.92,14.74 70.94,14.91 70.99,15.06 71.06,15.19 71.16,15.31 71.28,15.41 71.41,15.48 71.56,15.53
N$8
  pour Top: 83.76,20.77 83.76,22.06 83.77,22.12 83.79,22.19 83.82,22.24 83.86,22.29 83.91,22.33 83.96,22.36 84.03,22.38 84.09,22.39 84.57,22.39 84.64,22.38 84.7,22.36 84.76,22.33 84.81,22.29 84.85,22.24 84.88,22.19 84.9,22.12 84.9,22.06 84.9,20.77 84.9,20.7 84.88,20.64 84.85,20.58 84.81,20.53 84.76,20.49 84.7,20.46 84.64,20.44 84.57,20.44 84.09,20.44 84.03,20.44 83.96,20.46 83.91,20.49 83.86,20.53 83.82,20.58 83.79,20.64 83.77,20.7
N$9
  Top 0.406: R11.2 Q3.1
N$10
  Bottom 0.203: R14.1 14.77,21.48 15.09,21.8 16.29,21.8 16.61,21.48 U3.2
N$11
  pour Top: 87.19,20.53 88.48,20.53 88.54,20.52 88.61,20.5 88.66,20.47 88.71,20.43 88.75,20.38 88.78,20.32 88.8,20.26 88.81,20.19 88.81,19.71 88.8,19.65 88.78,19.59 88.75,19.53 88.71,19.48 88.66,19.44 88.61,19.41 88.54,19.39 88.48,19.38 87.19,19.38 87.12,19.39 87.06,19.41 87,19.44 86.95,19.48 86.91,19.53 86.88,19.59 86.86,19.65 86.86,19.71 86.86,20.19 86.86,20.26 86.88,20.32 86.91,20.38 86.95,20.43 87,20.47 87.06,20.5 87.12,20.52
N$12
  pour Top: 91.84,20.53 93.13,20.53 93.2,20.52 93.26,20.5 93.32,20.47 93.37,20.43 93.41,20.38 93.44,20.32 93.46,20.26 93.46,20.19 93.46,19.71 93.46,19.65 93.44,19.59 93.41,19.53 93.37,19.48 93.32,19.44 93.26,19.41 93.2,19.39 93.13,19.38 91.84,19.38 91.78,19.39 91.71,19.41 91.66,19.44 91.61,19.48 91.57,19.53 91.54,19.59 91.52,19.65 91.51,19.71 91.51,20.19 91.52,20.26 91.54,20.32 91.57,20.38 91.61,20.43 91.66,20.47 91.71,20.5 91.78,20.52
N$13
  pour Top: 78.36,25.71 79.65,25.71 79.71,25.7 79.78,25.68 79.83,25.65 79.88,25.61 79.92,25.56 79.95,25.5 79.97,25.44 79.98,25.37 79.98,24.9 79.97,24.83 79.95,24.77 79.92,24.71 79.88,24.66 79.83,24.62 79.78,24.59 79.71,24.57 79.65,24.56 78.36,24.56 78.29,24.57 78.23,24.59 78.17,24.62 78.12,24.66 78.08,24.71 78.05,24.77 78.03,24.83 78.02,24.9 78.02,25.37 78.03,25.44 78.05,25.5 78.08,25.56 78.12,25.61 78.17,25.65 78.23,25.68 78.29,25.7
N$14
  pour Top: 68.87,25.84 70.16,25.84 70.23,25.83 70.29,25.81 70.35,25.78 70.39,25.74 70.44,25.69 70.47,25.63 70.49,25.57 70.49,25.5 70.49,25.03 70.49,24.96 70.47,24.9 70.44,24.84 70.39,24.79 70.35,24.75 70.29,24.72 70.23,24.7 70.16,24.69 68.87,24.69 68.8,24.7 68.74,24.72 68.69,24.75 68.64,24.79 68.6,24.84 68.56,24.9 68.55,24.96 68.54,25.03 68.54,25.5 68.55,25.57 68.56,25.63 68.6,25.69 68.64,25.74 68.69,25.78 68.74,25.81 68.8,25.83
N$16
  pour Top: 64.95,25.84 66.24,25.84 66.31,25.83 66.37,25.81 66.43,25.78 66.48,25.74 66.52,25.69 66.55,25.63 66.57,25.57 66.57,25.5 66.57,25.03 66.57,24.96 66.55,24.9 66.52,24.84 66.48,24.79 66.43,24.75 66.37,24.72 66.31,24.7 66.24,24.69 64.95,24.69 64.89,24.7 64.82,24.72 64.77,24.75 64.72,24.79 64.68,24.84 64.65,24.9 64.63,24.96 64.62,25.03 64.62,25.5 64.63,25.57 64.65,25.63 64.68,25.69 64.72,25.74 64.77,25.78 64.82,25.81 64.89,25.83
N$17
  pour Top: 31.52,16.35 41.5,22.53 42.01,22.82 42.74,23.03 43.62,23.16 44.59,23.21 45.57,23.18 46.5,23.05 47.32,22.84 47.96,22.53 58.05,16.23 58.41,15.9 58.64,15.51 58.77,15.07 58.78,14.61 58.71,14.16 58.56,13.73 58.34,13.34 58.06,13.03 49.78,7.76 48.71,7.05 47.57,6.51 46.38,6.16 45.13,5.99 43.85,6.03 42.53,6.28 41.2,6.75 39.87,7.45 31.22,12.93 30.83,13.23 30.55,13.62 30.37,14.06 30.32,14.55 30.4,15.04 30.62,15.52 30.99,15.97
N$18
  pour Bottom: 71.72,15.54 71.88,15.53 72.03,15.48 72.17,15.41 72.29,15.31 72.39,15.19 72.46,15.06 72.51,14.91 72.52,14.74 72.51,14.58 72.46,14.43 72.39,14.3 72.29,14.18 72.17,14.08 72.03,14.01 71.88,13.96 71.72,13.94 71.56,13.96 71.41,14.01 71.28,14.08 71.16,14.18 71.06,14.3 70.99,14.43 70.94,14.58 70.92,14.74 70.94,14.91 70.99,15.06 71.06,15.19 71.16,15.31 71.28,15.41 71.41,15.48 71.56,15.53
N$19
  pour Bottom: 83.76,20.77 83.76,22.06 83.77,22.12 83.79,22.19 83.82,22.24 83.86,22.29 83.91,22.33 83.96,22.36 84.03,22.38 84.09,22.39 84.57,22.39 84.64,22.38 84.7,22.36 84.76,22.33 84.81,22.29 84.85,22.24 84.88,22.19 84.9,22.12 84.9,22.06 84.9,20.77 84.9,20.7 84.88,20.64 84.85,20.58 84.81,20.53 84.76,20.49 84.7,20.46 84.64,20.44 84.57,20.44 84.09,20.44 84.03,20.44 83.96,20.46 83.91,20.49 83.86,20.53 83.82,20.58 83.79,20.64 83.77,20.7
N$20
  pour Bottom: 87.19,20.53 88.48,20.53 88.54,20.52 88.61,20.5 88.66,20.47 88.71,20.43 88.75,20.38 88.78,20.32 88.8,20.26 88.81,20.19 88.81,19.71 88.8,19.65 88.78,19.59 88.75,19.53 88.71,19.48 88.66,19.44 88.61,19.41 88.54,19.39 88.48,19.38 87.19,19.38 87.12,19.39 87.06,19.41 87,19.44 86.95,19.48 86.91,19.53 86.88,19.59 86.86,19.65 86.86,19.71 86.86,20.19 86.86,20.26 86.88,20.32 86.91,20.38 86.95,20.43 87,20.47 87.06,20.5 87.12,20.52
N$21
  pour Bottom: 91.84,20.53 93.13,20.53 93.2,20.52 93.26,20.5 93.32,20.47 93.37,20.43 93.41,20.38 93.44,20.32 93.46,20.26 93.46,20.19 93.46,19.71 93.46,19.65 93.44,19.59 93.41,19.53 93.37,19.48 93.32,19.44 93.26,19.41 93.2,19.39 93.13,19.38 91.84,19.38 91.78,19.39 91.71,19.41 91.66,19.44 91.61,19.48 91.57,19.53 91.54,19.59 91.52,19.65 91.51,19.71 91.51,20.19 91.52,20.26 91.54,20.32 91.57,20.38 91.61,20.43 91.66,20.47 91.71,20.5 91.78,20.52
N$22
  pour Bottom: 78.36,25.71 79.65,25.71 79.71,25.7 79.78,25.68 79.83,25.65 79.88,25.61 79.92,25.56 79.95,25.5 79.97,25.44 79.98,25.37 79.98,24.9 79.97,24.83 79.95,24.77 79.92,24.71 79.88,24.66 79.83,24.62 79.78,24.59 79.71,24.57 79.65,24.56 78.36,24.56 78.29,24.57 78.23,24.59 78.17,24.62 78.12,24.66 78.08,24.71 78.05,24.77 78.03,24.83 78.02,24.9 78.02,25.37 78.03,25.44 78.05,25.5 78.08,25.56 78.12,25.61 78.17,25.65 78.23,25.68 78.29,25.7
N$23
  pour Bottom: 68.87,25.84 70.16,25.84 70.23,25.83 70.29,25.81 70.35,25.78 70.39,25.74 70.44,25.69 70.47,25.63 70.49,25.57 70.49,25.5 70.49,25.03 70.49,24.96 70.47,24.9 70.44,24.84 70.39,24.79 70.35,24.75 70.29,24.72 70.23,24.7 70.16,24.69 68.87,24.69 68.8,24.7 68.74,24.72 68.69,24.75 68.64,24.79 68.6,24.84 68.56,24.9 68.55,24.96 68.54,25.03 68.54,25.5 68.55,25.57 68.56,25.63 68.6,25.69 68.64,25.74 68.69,25.78 68.74,25.81 68.8,25.83
N$24
  pour Bottom: 64.95,25.84 66.24,25.84 66.31,25.83 66.37,25.81 66.43,25.78 66.48,25.74 66.52,25.69 66.55,25.63 66.57,25.57 66.57,25.5 66.57,25.03 66.57,24.96 66.55,24.9 66.52,24.84 66.48,24.79 66.43,24.75 66.37,24.72 66.31,24.7 66.24,24.69 64.95,24.69 64.89,24.7 64.82,24.72 64.77,24.75 64.72,24.79 64.68,24.84 64.65,24.9 64.63,24.96 64.62,25.03 64.62,25.5 64.63,25.57 64.65,25.63 64.68,25.69 64.72,25.74 64.77,25.78 64.82,25.81 64.89,25.83
N$25
  pour Bottom: 31.52,16.35 41.5,22.53 42.01,22.82 42.74,23.03 43.62,23.16 44.59,23.21 45.57,23.18 46.5,23.05 47.32,22.84 47.96,22.53 58.05,16.23 58.41,15.9 58.64,15.51 58.77,15.07 58.78,14.61 58.71,14.16 58.56,13.73 58.34,13.34 58.06,13.03 49.78,7.76 48.71,7.05 47.57,6.51 46.38,6.16 45.13,5.99 43.85,6.03 42.53,6.28 41.2,6.75 39.87,7.45 31.22,12.93 30.83,13.23 30.55,13.62 30.37,14.06 30.32,14.55 30.4,15.04 30.62,15.52 30.99,15.97
N$27
  Top 0.254: 10.26,22.19 10.26,21.99 | 10.26,21.99 10.26,21.53 10.03,21.24 9.54,21.24 7.34,19.36 7.34,16.85 JP1.2 | 10.26,21.99 U$4.4
N$28
  Top 0.406: R15.2 10.83,1.61 11.15,2.12 11.98,2.12 Q3.2
RST  (via drill 0.35)
  Top 0.203: 68.27,19.01 C7.2
  Top 0.254: U1.29 75.86,17.77 75.09,18.54 75.05,20.01 74.46,20.58 73.67,20.56 72.78,22.06 69.38,22.06 68.87,21.55 68.87,19.9 C7.2 | 68.27,19.01 67.28,18.96 66.99,18.39 65,18.37 63.98,18.39 63.96,18.37 62.72,16.75 62.72,13.82 v62.77,13.77 | v60.55,13.23 60.55,11.39 51.15,4.78 40.65,4.78 38.01,6.37 ICSP.3
  Top 0.305: R12.1 63.29,24.37 63.29,19.04 63.96,18.37
  Bottom 0.254: v62.77,13.77 61.54,13.77 61.44,13.8 v60.55,13.23
S1  (via drill 0.35)
  Top 0.203: v68.17,8.34 v66.39,6.56
  Top 0.254: v63.22,4.96 52.61,5.04 51.35,4.15 41.5,4.15 | 41.5,4.15 41.25,4.15 | v38.45,5.16 39.85,4.15 41.5,4.15 | v35.03,7.58 27.28,7.58 ICSP.1
  Top 0.305: U1.16 v85.25,14.75
  Top 0.406: v87.83,18.59 86.9,18.63 86.3,19.2 86.3,20.56 86.84,21.23 S1+.P$1
  Bottom 0.203: v68.17,8.34 74.52,8.34 75.03,8.85 80.24,8.85 85.25,13.93 v85.25,14.75 | 63.23,4.85 v63.22,4.96
  Bottom 0.254: v66.39,6.56 64.49,4.85 63.23,4.85 | v35.03,7.58 v38.45,5.16
  Bottom 0.406: v87.83,18.59 88.33,17.1 86.21,14.75 v85.25,14.75
S2  (via drill 0.35)
  Top 0.203: 73.8,16.29 U1.32
  Top 0.305: S2+.P$1 64.54,26.55 64.04,25.99 64.04,19.83 v64.49,19.39 | 73.8,16.29 73.39,15.9 73.21,16.12 72.36,16.12 70.6,17.82 v70.59,18.59
  Bottom 0.305: v70.59,18.59 65.14,18.61 v64.49,19.39
S3
  Top 0.305: U1.12 82.56,10.97 83.82,11.47 86.92,11.47 87.97,10.48 87.98,7.58 88.52,6.97 90.94,6.97 U$1.S3
S5
  Top 0.305: 93.38,6.68 U$1.S5 | 92.56,6.89 U$1.S5 | U$1.S5 92.63,6.89 91.48,6.31 88.25,6.33 87.35,7.36 87.35,10.1 86.49,10.91 83.95,10.91 82.27,10.24 81.82,10.5 U1.11
S8@3.3V  (via drill 0.35)
  Top 0.254: U1.24 79.29,19.1 v79.41,18 | 25.1,20.86 25.13,20.9 R10.1 25.65,21.42 26.83,21.42 v27.15,21.74 | v72.91,19.65 72.55,19.67 70.14,19.67 70.11,19.67 v69.82,19.39
  Top 0.305: R9.2 23.13,19.77 24.48,19.77 25.13,20.42 25.13,20.9
  Bottom 0.203: 48.3,25.55 49.06,25.55
  Bottom 0.254: v79.41,18 78.99,18.03 77.1,19.83 76.84,19.83 75.01,19.83 74.57,20.27 73.38,20.26 v72.91,19.65 | v27.15,21.74 27.15,22.69 28.1,23.64 33.34,23.64 33.82,24.12 34.3,24.12 35.72,25.55 48.3,25.55 58.14,25.45 58.68,24.91
  Bottom 0.305: v69.82,19.39 65.76,19.39 64.58,20.84 64.53,20.86 59.12,20.88 58.68,21.33 58.68,24.91
S8@6V  (via drill 0.35)
  Top 0.305: v64.11,10.24 61.3,12.49 61.31,16.72 56.22,19.92 56.22,24.22 55.66,24.56 34.87,24.5 32.87,23.52 29.31,23.52 28.1,22.37 28.1,19.96 26.39,18.69 R9.1
  Top 0.61: U$1.S8 89.95,16.85 90.4,17.36 v90.65,17.61
  Bottom 0.305: v90.65,17.61 90.02,16.98 90.02,15.83 86.23,12.1 86.26,9.55 85.63,9 85.59,8.98 82.12,8.98 78.81,5.74 73.89,5.8 73.21,6.58 68.27,6.58 | 68.27,6.58 68.39,6.59 | 68.27,6.58 v64.11,10.24
S9@3.3V  (via drill 0.35)
  Top 0.254: U1.23 80.72,19.37 80.2,18.85 80.32,17.88 80.4,17.04 v80.78,16.66 | v33.72,22.93 33.44,22.91
  Top 0.305: 33.44,22.91 29.63,22.91 28.74,21.95 28.8,18.06 25.75,16.02 22.08,16.03 | 22.08,16.03 R6.1 | v74.14,19.51 72.36,17.78 v71.82,17.77 | R5.2 18.68,14.69 21.31,14.69 22.08,15.71 22.08,16.03
  Bottom 0.203: v33.72,22.93 33.88,23.01
  Bottom 0.254: v80.78,16.66 80.63,16.58 79.79,16.58 77.45,18.77 76.95,19.23 76.43,19.24 74.29,19.24 v74.14,19.51 | v71.82,17.77 64.6,17.73 64.37,17.78 63.83,18.35 61.89,20.35 58.96,20.33 58.2,21.1 58.2,24.38 57.66,24.94 48.56,25.07 35.98,25.04 33.88,23.01
S9@6V  (via drill 0.35)
  Top 0.254: 91.16,15.71 v91.16,15.77
  Top 0.305: v60.43,10.31 65.38,5.36 69.83,5.36 v69.86,5.39 | v63.75,11.93 61.86,13.51 61.92,17.04 57.22,19.93 v57.22,24.02 | R5.1 24.04,13.42 29.69,17.29 v29.69,21.74
  Top 0.61: U$1.S9 90.71,15.32 91.16,15.71
  Bottom 0.254: v60.43,10.31 62.77,11.93 v63.75,11.93 | v29.69,21.74 30.01,22.06 34.33,22.06 35.09,22.82 35.09,23.2 36.32,24.43 56.87,24.4 v57.22,24.02
  Bottom 0.305: v91.16,15.77 87,11.61 87,9.01 86.29,8.3 86.23,8.28 82.52,8.28 79.22,5.16 73.6,5.16 73.37,5.42 72.85,5.98 71.38,5.98 70.76,5.37 v69.86,5.39
SCL  (via drill 0.35)
  Top 0.203: 76.36,18.25 U1.28
  Top 0.254: 76.36,18.25 76.84,17.77 v76.84,16.75
  Top 0.305: v65.82,11.74 65.8,10.12 65.8,10.06 65,9.32 v62.9,9.32 | SCL.TP 12.42,15.71 12.42,15.32 13.05,14.69 v14.96,14.69
  Bottom 0.203: 16.1,17.17 16.1,17.26 | 16.1,18.13 U3.6
  Bottom 0.254: v76.84,16.75 76.84,14.82 76.27,14.28 73.28,14.28 72.24,13.1 71.19,13.1 70.33,13.96 69.54,13.96 67.25,11.74 v65.82,11.74 | v62.9,9.32 53.35,2.81 25.63,2.81 16.12,13.1 16.08,14.69 | 16.08,14.69 16.1,17.17 | 16.1,17.26 16.1,18.13 | v14.96,14.69 16.08,14.69
SDA  (via drill 0.35)
  Top 0.203: 77,18.72 U1.27
  Top 0.254: 77,18.72 78.11,17.61 v78.11,16.98
  Top 0.305: v9.43,18.63 11.03,18.57 | 11.03,18.57 13.88,15.83 v17.63,15.83 | SDA.TP 10.37,17.59 9.32,18.56 11.03,18.57
  Bottom 0.203: v78.11,16.98 76.47,18.56 76.25,18.57 73.92,18.58 74.14,18.58 73.3,18.56 72.96,18.56 72.24,19.26 72,19.27 71.28,20.01 71.19,20.1 69.35,22.05 69.06,22.06 61.77,22.09 61.05,22.89 59.27,22.86 | U3.4 17.11,16.38 17.66,15.83 v17.63,15.83
  Bottom 0.254: 59.27,22.86 59.36,25.17 60.3,26.12 60.3,26.88 59.76,27.17 32.87,27.23 31.88,26.06 31.88,25.23 14.96,25.23 14.07,26.5 7.15,26.5 5.47,24.31 5.56,13.17 6.13,12.53 6.44,12.57 8.77,12.56 9.4,13.29 v9.43,18.63
SOL1
  Top 0.305: R1.1 73.6,8.65 72.1,8.65 70.47,9.3 70.46,12.54 72.59,13.63 73.69,13.63 U1.1
SOL1-
  Top 0.813: SOL1.SOL1- 81.26,5.07 D1.A 82.65,6.5 82.79,6.76 82.85,7.38 Q1.3
SOL2  (via drill 0.35)
  Top 0.203: 83.51,13.32 U1.15
  Top 0.254: v60.06,23.71 60.04,24.09 58.67,25.46 58.67,25.58 58.65,25.6 58.65,25.62 58.55,25.71 57.63,26.63 33.37,26.75 31.6,25.48 27.02,25.48 v24.99,23.2 | v27.63,14.3 30.71,16.44 v30.71,19.26 | v65.25,23.01 66.46,23.01 66.65,22.82 66.65,21.8 67.28,21.17 R3.1
  Top 0.406: 83.51,13.32 v82.43,14.4
  Bottom 0.152: 27.68,9.78 27.79,9.67
  Bottom 0.203: v65.25,23.01 65.66,22.6 76.05,22.6 82.43,16.02 v82.43,14.4
  Bottom 0.254: v65.25,23.01 61.89,23.01 61.19,23.71 60.04,23.71 v60.06,23.71 | v30.71,19.26 28.99,20.98 26.84,20.98 26.39,21.42 26.39,21.8 v24.99,23.2
  Bottom 0.406: 27.68,9.78 v27.63,14.3 | 27.79,9.67 ICSP.5
SOL2-
  Top 0.203: 76.36,22.69 Q2.3
  Top 0.813: SOL2-.P$1 78.23,26.27 arc90 77.44,25.48 | 77.44,25.48 77.44,22.82 77.32,22.69 Q2.3 | D2.A 77.44,25.74 77.44,25.48
TXD  (via drill 0.35)
  Top 0.203: 74.62,16.66 U1.31 | v7.72,21.9 8.95,21.9 9.24,22.16 | 9.24,22.16 9.25,22.31 | v18.9,16.82 v15.25,16.82 | 9.24,22.16 9.27,22.19 U$4.2
  Top 0.254: v52.46,6.56 52.49,6.54 50.79,5.41 41.01,5.41 41.03,5.42 30.29,12.21 v23.72,12.12
  Top 0.305: 74.62,16.66 74.14,17.13 73.3,17.13 v72.87,16.82
  Bottom 0.254: v72.87,16.82 72.46,16.28 71.16,16.28 67.63,12.94 61.28,12.88 52.58,6.59 v52.46,6.56 | v7.72,21.9 10.28,19.52 10.32,16.41 10.83,15.9 15.25,15.9 v15.25,16.82 | v23.72,12.12 v18.9,16.82

### Text on the board
Top: top
Bottom: bottom
Dimension: CUT OUT | CUT OUT | CUT OUT | CUT OUT | CUT OUT | CUT OUT | CUT OUT | CUT OUT
tPlace: www.openSX70.com | www.openSX70.com | S2+ | S2- | DTR | TXD | RXD | VCC | GND | "aladdin-fpc-s" | K | F+ | FF | F- | SOL2- | FTDI | FT | layout 3.9.7S | Q2 | SOL2+ | S1+ | S1- | 2.5V | S8 | 6V | S9 | VCC-6V | X1 | MOTOR | 6V | VCC | MOSI | GND | 20180213 | GND | Q1 | S3 | 2.5V | S5 | GND | BUZZ-AMP. | K | MISO | SCK | RST | SOL1+ | SOL1-
bPlace: www.openSX70.com | "aladdin-fpc-S" | layout 3.9.7S | LIGHT / METER | BUZZER
tNames: VCC IN SEL
bNames: B+ | GND | A+ | LED
tDocu: Creative Commons "Attribution-NonCommercial 4.0 International (CC BY-NC 4.0)" / https://creativecommons.org/licenses/by-nc/4.0/ | ALL VIAS TENTED | openSX70 project visit www.openSX70.com / version 3.9.7S "Aladdin-fpc-S" 20170213 / by Joaquín de Prada